# EAGLE design tinyclock (EAGLE 8.3.2)
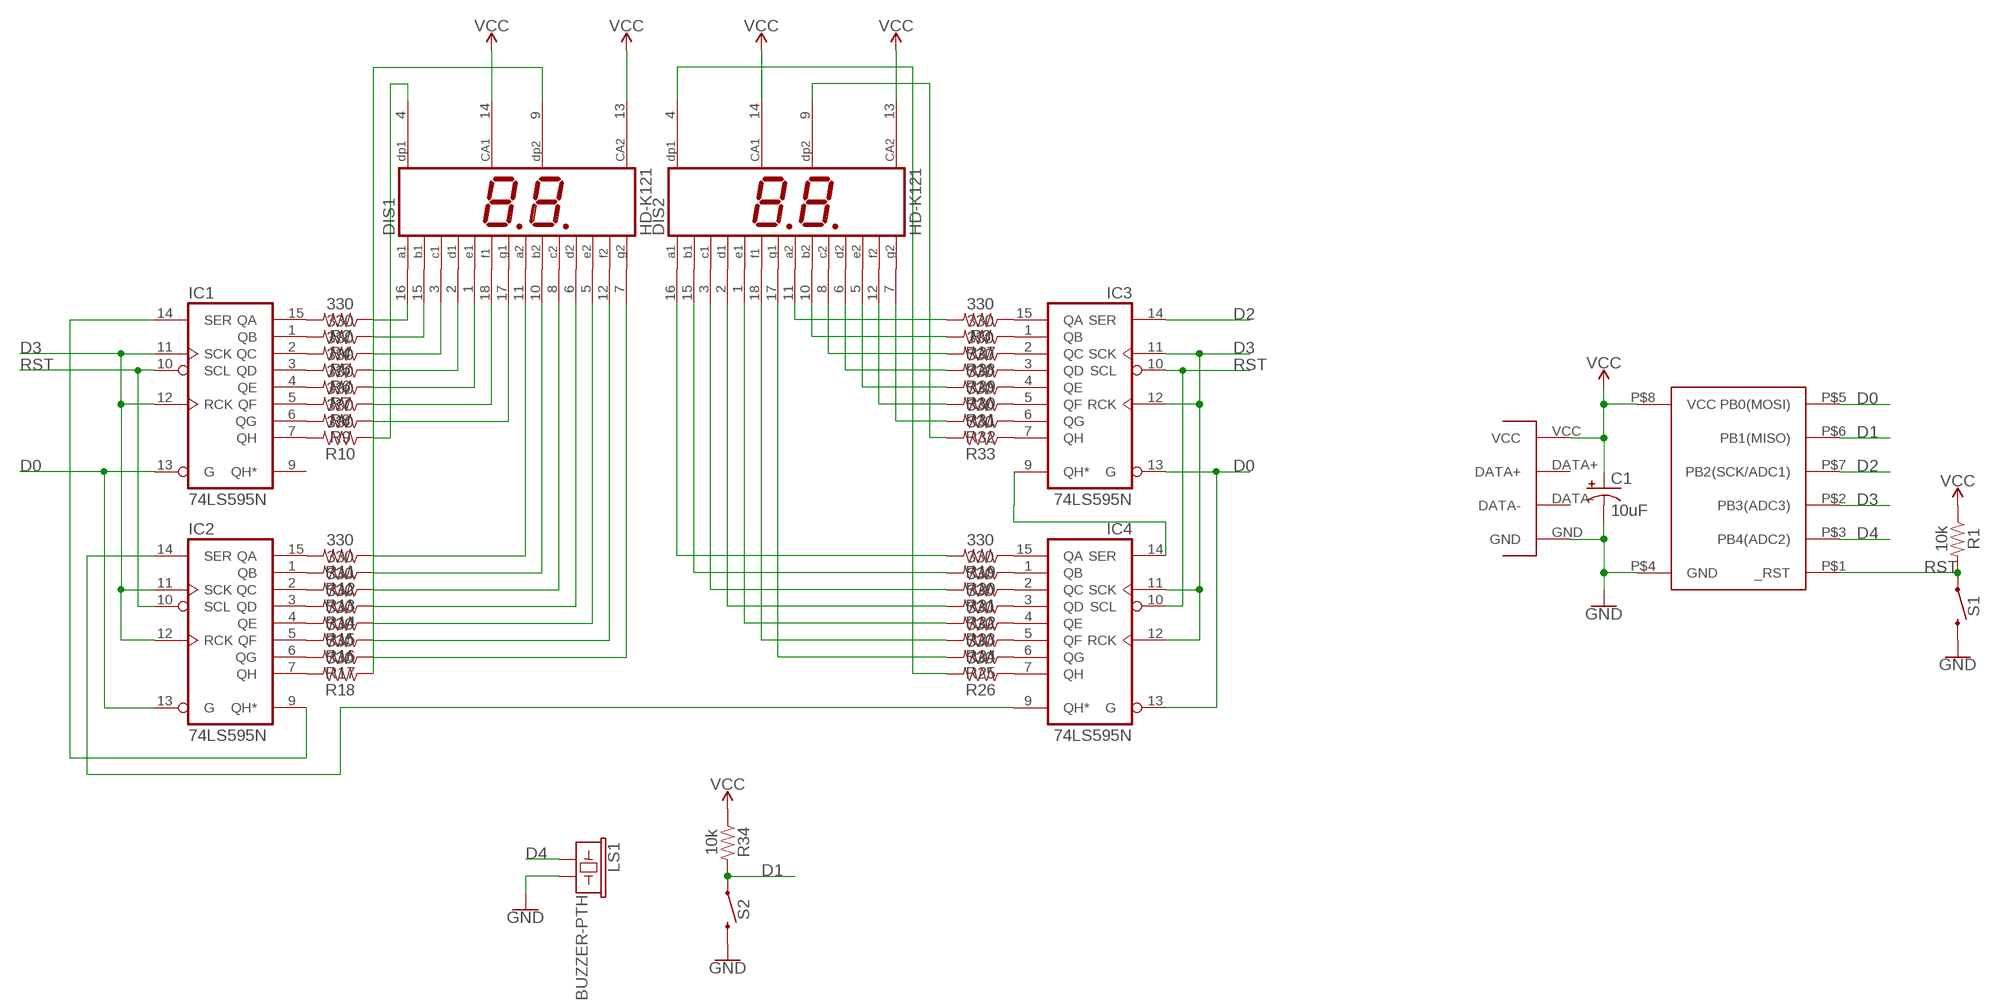
[diagram p0: schematic, sheet 1]

## Parts
C1  10uF  1000UF-RADIAL-5MM-25V-20%  [CPOL-RADIAL-5MM-10MM]
DIS1  HD-K121  [HDSP-R]
DIS2  HD-K121  [HDSP-R]
IC1  74LS595N  [DIL16]
IC2  74LS595N  [DIL16]
IC3  74LS595N  [DIL16]
IC4  74LS595N  [DIL16]
LS1  BUZZER-PTH  [BUZZER-12MM]
R1  10k  1KOHM-VERT-1/4W-5%  [AXIAL-0.1]
R2  330  1KOHM-VERT-1/4W-5%  [AXIAL-0.1]
R3  330  1KOHM-VERT-1/4W-5%  [AXIAL-0.1]
R4  330  1KOHM-VERT-1/4W-5%  [AXIAL-0.1]
R5  330  1KOHM-VERT-1/4W-5%  [AXIAL-0.1]
R6  330  1KOHM-VERT-1/4W-5%  [AXIAL-0.1]
R7  330  1KOHM-VERT-1/4W-5%  [AXIAL-0.1]
R8  330  1KOHM-VERT-1/4W-5%  [AXIAL-0.1]
R9  330  1KOHM-VERT-1/4W-5%  [AXIAL-0.1]
R10  330  1KOHM-VERT-1/4W-5%  [AXIAL-0.1]
R11  330  1KOHM-VERT-1/4W-5%  [AXIAL-0.1]
R12  330  1KOHM-VERT-1/4W-5%  [AXIAL-0.1]
R13  330  1KOHM-VERT-1/4W-5%  [AXIAL-0.1]
R14  330  1KOHM-VERT-1/4W-5%  [AXIAL-0.1]
R15  330  1KOHM-VERT-1/4W-5%  [AXIAL-0.1]
R16  330  1KOHM-VERT-1/4W-5%  [AXIAL-0.1]
R17  330  1KOHM-VERT-1/4W-5%  [AXIAL-0.1]
R18  330  1KOHM-VERT-1/4W-5%  [AXIAL-0.1]
R19  330  1KOHM-VERT-1/4W-5%  [AXIAL-0.1]
R20  330  1KOHM-VERT-1/4W-5%  [AXIAL-0.1]
R21  330  1KOHM-VERT-1/4W-5%  [AXIAL-0.1]
R22  330  1KOHM-VERT-1/4W-5%  [AXIAL-0.1]
R23  330  1KOHM-VERT-1/4W-5%  [AXIAL-0.1]
R24  330  1KOHM-VERT-1/4W-5%  [AXIAL-0.1]
R25  330  1KOHM-VERT-1/4W-5%  [AXIAL-0.1]
R26  330  1KOHM-VERT-1/4W-5%  [AXIAL-0.1]
R27  330  1KOHM-VERT-1/4W-5%  [AXIAL-0.1]
R28  330  1KOHM-VERT-1/4W-5%  [AXIAL-0.1]
R29  330  1KOHM-VERT-1/4W-5%  [AXIAL-0.1]
R30  330  1KOHM-VERT-1/4W-5%  [AXIAL-0.1]
R31  330  1KOHM-VERT-1/4W-5%  [AXIAL-0.1]
R32  330  1KOHM-VERT-1/4W-5%  [AXIAL-0.1]
R33  330  1KOHM-VERT-1/4W-5%  [AXIAL-0.1]
R34  10k  1KOHM-VERT-1/4W-5%  [AXIAL-0.1]
S1  MOMENTARY-SWITCH-SPST-PTH-6.0MM  [TACTILE_SWITCH_PTH_6.0MM]
S2  MOMENTARY-SWITCH-SPST-PTH-6.0MM  [TACTILE_SWITCH_PTH_6.0MM]
U$1  ATTINY85-DIP8  [DIP8]
U$2  USBPCB  [USBPCB]

## Nets
D0: IC1.13(G) IC2.13(G) IC3.13(G) IC4.13(G) U$1.P$5(PB0(MOSI))
D1: R34.P$2 S2.1 U$1.P$6(PB1(MISO))
D2: IC3.14(SER) U$1.P$7(PB2(SCK/ADC1))
D3: IC1.11(SCK) IC1.12(RCK) IC2.11(SCK) IC2.12(RCK) IC3.11(SCK) IC3.12(RCK) IC4.11(SCK) IC4.12(RCK) U$1.P$2(PB3(ADC3))
D4: LS1.+ U$1.P$3(PB4(ADC2))
GND: C1.- LS1.- S1.3 S2.3 U$1.P$4(GND) U$2.GND
N$1: IC1.15(QA) R2.P$2
N$2: IC2.14(SER) IC4.9(QH*)
N$3: DIS1.16(A1) R2.P$1
N$4: IC1.1(QB) R4.P$2
N$5: IC1.2(QC) R5.P$2
N$6: IC1.3(QD) R6.P$2
N$7: IC1.4(QE) R7.P$2
N$8: IC1.5(QF) R8.P$2
N$9: IC1.6(QG) R9.P$2
N$10: IC1.7(QH) R10.P$2
N$11: DIS1.15(B1) R4.P$1
N$12: DIS1.3(C1) R5.P$1
N$13: DIS1.2(D1) R6.P$1
N$14: DIS1.1(E1) R7.P$1
N$15: DIS1.18(F1) R8.P$1
N$16: DIS1.17(G1) R9.P$1
N$17: IC2.15(QA) R11.P$2
N$18: IC2.1(QB) R12.P$2
N$19: IC2.2(QC) R13.P$2
N$20: IC2.3(QD) R14.P$2
N$21: IC2.4(QE) R15.P$2
N$22: IC2.5(QF) R16.P$2
N$23: IC2.6(QG) R17.P$2
N$24: IC2.7(QH) R18.P$2
N$25: IC3.15(QA) R3.P$1
N$26: IC3.1(QB) R27.P$1
N$27: IC3.2(QC) R28.P$1
N$28: IC3.3(QD) R29.P$1
N$29: IC3.4(QE) R30.P$1
N$30: IC3.5(QF) R31.P$1
N$31: IC3.6(QG) R32.P$1
N$32: IC3.7(QH) R33.P$1
N$33: IC4.15(QA) R19.P$1
N$34: IC4.1(QB) R20.P$1
N$35: IC4.2(QC) R21.P$1
N$36: IC4.3(QD) R22.P$1
N$37: IC4.4(QE) R23.P$1
N$38: IC4.5(QF) R24.P$1
N$39: IC4.6(QG) R25.P$1
N$40: IC4.7(QH) R26.P$1
N$41: DIS1.4(DP1) R10.P$1
N$42: DIS1.11(A2) R11.P$1
N$43: DIS1.10(B2) R12.P$1
N$44: DIS1.8(C2) R13.P$1
N$45: DIS1.6(D2) R14.P$1
N$46: DIS1.5(E2) R15.P$1
N$47: DIS1.12(F2) R16.P$1
N$48: DIS1.7(G2) R17.P$1
N$49: DIS1.9(DP2) R18.P$1
N$50: DIS2.11(A2) R3.P$2
N$51: DIS2.10(B2) R27.P$2
N$52: DIS2.8(C2) R28.P$2
N$53: DIS2.6(D2) R29.P$2
N$54: DIS2.5(E2) R30.P$2
N$55: DIS2.12(F2) R31.P$2
N$56: DIS2.7(G2) R32.P$2
N$57: DIS2.9(DP2) R33.P$2
N$58: DIS2.16(A1) R19.P$2
N$59: DIS2.15(B1) R20.P$2
N$60: DIS2.3(C1) R21.P$2
N$61: DIS2.2(D1) R22.P$2
N$62: DIS2.1(E1) R23.P$2
N$63: DIS2.18(F1) R24.P$2
N$64: DIS2.17(G1) R25.P$2
N$65: DIS2.4(DP1) R26.P$2
N$66: IC3.9(QH*) IC4.14(SER)
N$70: IC1.14(SER) IC2.9(QH*)
RST: IC1.10(SCL) IC2.10(SCL) IC3.10(SCL) IC4.10(SCL) R1.P$2 S1.1 U$1.P$1(_RST)
VCC: C1.+ DIS1.13(CA2) DIS1.14(CA1) DIS2.13(CA2) DIS2.14(CA1) R1.P$1 R34.P$1 U$1.P$8(VCC) U$2.VCC
Unconnected: IC1.9(QH*) U$2.DATA+ U$2.DATA-

## Power pins joined to a net without a drawn wire
GND: IC1.8(GND) IC2.8(GND) IC3.8(GND) IC4.8(GND)
VCC: IC1.16(VCC) IC2.16(VCC) IC3.16(VCC) IC4.16(VCC)

## Library data of the parts
C1 = SparkFun-Capacitors:1000UF: 1,000µF/1mF ceramic capacitors A capacitor is a passive two-terminal electrical component used to store electrical energy temporarily in an electric field. CAP-08070; PROD_ID: CAP-09538; VALUE: 1mF
DIS1 DIS2 = display-hp:HD-K121: LED DISPLAY 2 x 1 character 7 segment, decimal points right; OC_FARNELL: unknown; OC_NEWARK: unknown
IC1-IC4 = 74xx-us:74*595: 8-bit SHIFT REGISTER, output latch
LS1 = SparkFun-Electromechanical:BUZZER: Buzzer Small round buzzers that operate around the audible 2kHz range. You can use these as speakers to create simple music or user interfaces. Variant Overview: PTH - Mini Speaker - PC Mount 12mm 2.048kHz <https://www.sparkfun.com/products/7950> PTH_KIT - Mini Speaker - PC Mount 12mm 2.048kHz <https://www.sparkfun.com/products/7950> KIT simplifies soldering by adding stop mask to one side of the pads. PTH_NO_SILK - Mini Speaker - PC Mount 12mm 2.048kHz <https://www.sparkfun.com/products/7950> No silkscreen indicator of buzzer outline. PTH_KIT_NO_SILK - Mini Speaker - PC Mount 12mm 2.048kHz <https://www.sparkfun.com/products/7950> KIT package w/o silkscreen SMD - Buzzer Audio Magnetic (CCV-084B16) SMD buzzer used on, e.g. the LilyPad Buzzer <https://www.sparkfun.com/products/8463> and RFID USB Reader <https://www.sparkfun.com/products/9963>. SMD_KIT - Buzzer Audio Magnetic (CCV-084B16) SMD Buzzer with elongated pins to make soldering easier. Used on the SparkFun Simon Says - Surface Mount Soldering Kit <https://www.sparkfun.com/products/10935>.; PROD_ID: COMP-08253; SF_SKU: COM-07950
R1-R34 = SparkFun-Resistors:1KOHM: 1kΩ resistor A resistor is a passive two-terminal electrical component that implements electrical resistance as a circuit element. Resistors act to reduce current flow, and, at the same time, act to lower voltage levels within circuits. - Wikipedia; PROD_ID: RES-08380; VALUE: 1k
S1 S2 = SparkFun-Switches:MOMENTARY-SWITCH-SPST: Momentary Switch (Pushbutton) - SPST Normally-open (NO) SPST momentary switches (buttons, pushbuttons). Variants PTH-12MM - 12mm square, through-hole Momentary Pushbutton Switch - 12mm Square <https://www.sparkfun.com/products/9190> (COM-09190) PTH-6.0MM, PTH-6.0MM-KIT - 6.0mm square, through-hole Mini Pushbutton Switch <https://www.sparkfun.com/products/97> (COM-00097) KIT package intended for soldering kit's - only one side of pads' copper is exposed. PTH-RIGHT-ANGLE-KIT - Right-angle, through-hole Right Angle Tactile Button <https://www.sparkfun.com/products/10791> - Used on SparkFun BigTime Watch Kit <https://www.sparkfun.com/products/11734> SMD-12MM - 12mm square, surface-mount Tactile Button - SMD (12mm) <https://www.sparkfun.com/products/12993> (COM-12993) Used on SparkFun PicoBoard <https://www.sparkfun.com/products/11888> SMD-4.5MM - 4.5mm Square Trackball Switch Used on SparkFun Blackberry Trackballer Breakout <https://www.sparkfun.com/products/13169> SMD-4.6MMX2.8MM - 4.60mm x 2.80mm, surface mount Used on SparkFun SAMD21 Mini Breakout <https://www.sparkfun.com/products/13664> SMD-5.2MM, SMD-5.2-REDUNDANT - 5.2mm square, surface-mount Mini Pushbutton Switch - SMD <https://www.sparkfun.com/products/8720> (COM-08720) Used on Arduino Pro Mini <https://www.sparkfun.com/products/11114> REDUNDANT package connects both switch circuits together SMD-6.0X3.5MM - 6.0 x 3.5mm, surface mount Momentary Reset Switch SMD <https://www.sparkfun.com/products/8229> (COM-08229) SMD-6.2MM-TALL - 6.2mm square, surface mount Tactile Button - SMD (6mm) <https://www.sparkfun.com/products/12992> Used on SparkFun Digital Sandbox <https://www.sparkfun.com/products/12651> SMD-RIGHT-ANGLE - Right-angle, surface mount Used on SparkFun Block for Intel® Edison - Arduino <https://www.sparkfun.com/products/13036>; PROD_ID: SWCH-08441; SF_SKU: COM-00097
U$1 = dip8pkg:ATTINY85-DIP8
U$2 = usbpcb:USBPCB

## Board
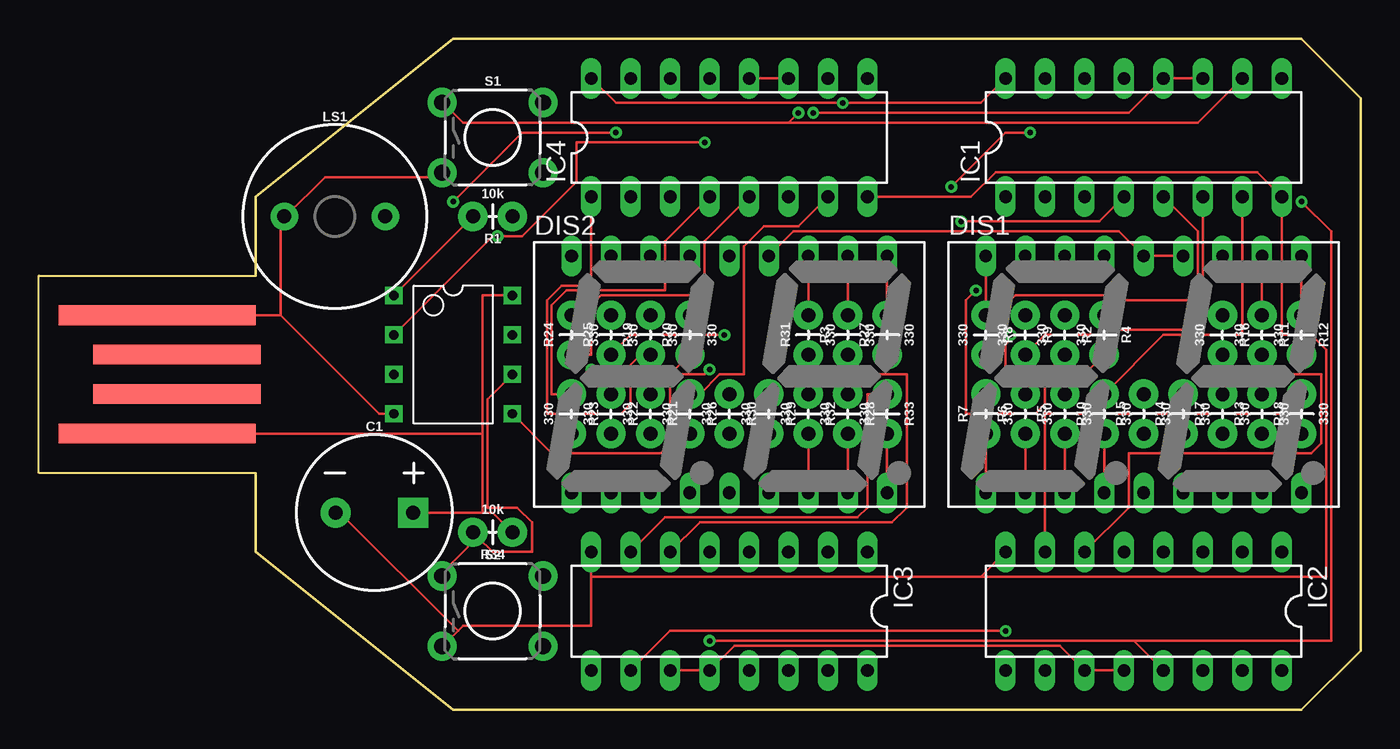
[diagram p1: board, top side]
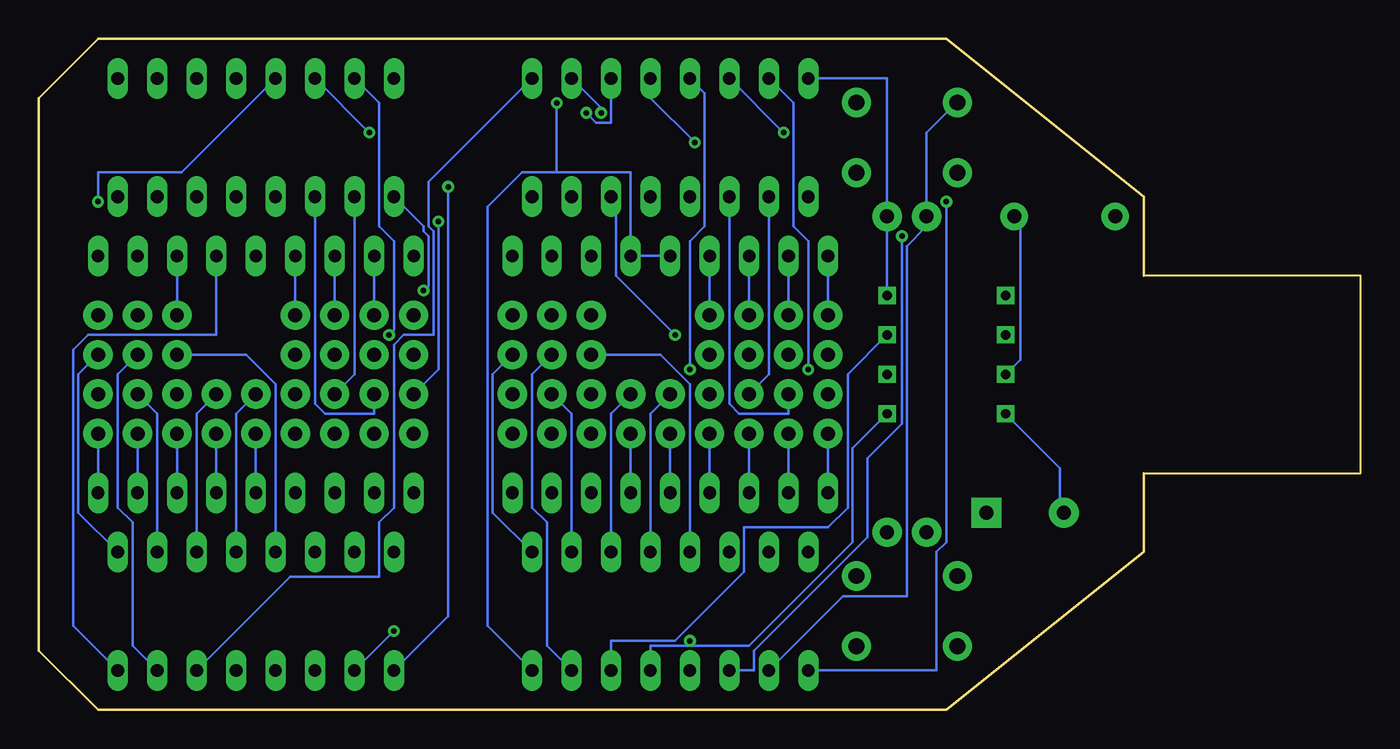
[diagram p2: board, bottom side, seen from below]

Size 85.09 x 43.18 mm. Coordinates in mm from the lower left corner, seen from the top.
Outline: 13.97,27.94 13.97,33.02 26.67,43.18 81.28,43.18 85.09,39.37 85.09,3.81 81.28,0 26.67,0 13.97,10.16 13.97,15.24
Copper layers (1*16): Top 0.035mm / dielectric 1.5mm / Bottom 0.035mm
Design rules "default": minimum track width 6mil, minimum drill 0.35mm, track to track 6mil, track to pad 6mil, pad to pad 6mil, via to via 6mil, smd to smd 6mil, copper to edge 40mil, drill to drill 6mil, minimum pad ring 10mil, minimum via ring 8mil, stop-mask expansion 4mil, vias tented up to drill 0mil, thermal gap 10mil

### Footprints (pad centres in the part's own frame; a part is rotated, then mirrored left to right if it is on the bottom)
CPOL-RADIAL-5MM-10MM = drill 0.9 pad 1.93 square: + 2.5,0 | drill 0.9 pad 1.93: - -2.5,0
HDSP-R = drill 0.813 long: 1 -10.16,-7.62; 2 -7.62,-7.62; 3 -5.08,-7.62; 4 -2.54,-7.62; 5 0,-7.62; 6 2.54,-7.62; 7 5.08,-7.62; 8 7.62,-7.62; 9 10.16,-7.62; 10 10.16,7.62; 11 7.62,7.62; 12 5.08,7.62; 13 2.54,7.62; 14 0,7.62; 15 -2.54,7.62; 16 -5.08,7.62; 17 -7.62,7.62; 18 -10.16,7.62
DIL16 = drill 0.813 long: 1 -8.89,-3.81; 2 -6.35,-3.81; 3 -3.81,-3.81; 4 -1.27,-3.81; 5 1.27,-3.81; 6 3.81,-3.81; 7 6.35,-3.81; 8 8.89,-3.81; 9 8.89,3.81; 10 6.35,3.81; 11 3.81,3.81; 12 1.27,3.81; 13 -1.27,3.81; 14 -3.81,3.81; 15 -6.35,3.81; 16 -8.89,3.81
BUZZER-12MM = drill 0.9 pad 1.778: + 3.25,0; - -3.25,0
AXIAL-0.1 = drill 0.9 pad 1.88: P$1 -1.27,0; P$2 1.27,0
TACTILE_SWITCH_PTH_6.0MM = drill 1.016 pad 1.88: 1 -3.251,2.261; 2 3.251,2.261; 3 -3.251,-2.261; 4 3.251,-2.261
DIP8 = drill 0.6 square: P$1 -3.81,3.81; P$2 -3.81,1.27; P$3 -3.81,-1.27; P$4 -3.81,-3.81; P$5 3.81,-3.81; P$6 3.81,-1.27; P$7 3.81,1.27; P$8 3.81,3.81
USBPCB = smd 1.27 x 10.795: DATA+ 1.27,2.54; DATA- -1.27,2.54 | smd 1.27 x 12.7: GND 3.81,3.81; VCC -3.81,3.81

### Placement (x,y rotation side)
C1  21.59,12.7 0 top
DIS1  71.12,21.59 0 top
DIS2  44.45,21.59 0 top
IC1  71.12,36.83 0 top
IC2  71.12,6.35 180 top
IC3  44.45,6.35 180 top
IC4  44.45,36.83 0 top
LS1  19.05,31.75 0 top
R1  29.21,31.75 180 top
R2  66.04,24.13 270 top
R3  52.07,24.13 90 top
R4  68.58,24.13 270 top
R5  66.04,19.05 90 top
R6  63.5,19.05 90 top
R7  60.96,19.05 90 top
R8  60.96,24.13 270 top
R9  63.5,24.13 270 top
R10  68.58,19.05 90 top
R11  78.74,24.13 270 top
R12  81.28,24.13 270 top
R13  78.74,19.05 90 top
R14  73.66,19.05 90 top
R15  71.12,19.05 90 top
R16  76.2,24.13 270 top
R17  76.2,19.05 90 top
R18  81.28,19.05 90 top
R19  39.37,24.13 90 top
R20  41.91,24.13 90 top
R21  39.37,19.05 270 top
R22  36.83,19.05 270 top
R23  34.29,19.05 270 top
R24  34.29,24.13 90 top
R25  36.83,24.13 90 top
R26  41.91,19.05 270 top
R27  54.61,24.13 90 top
R28  52.07,19.05 270 top
R29  46.99,19.05 270 top
R30  44.45,19.05 270 top
R31  49.53,24.13 90 top
R32  49.53,19.05 270 top
R33  54.61,19.05 270 top
R34  29.21,11.43 180 top
S1  29.21,36.83 0 top
S2  29.21,6.35 0 top
U$1  26.67,22.86 0 top
U$2  11.43,21.59 90 top

### Tracks (layer width: path | path; a pad name or v marks a point on that pad's centre or on a via)
D0  (via drill 0.35)
  Top 0.152: 70.48,4.45 IC2.13 | v43.18,4.45 70.48,4.45 | v43.18,21.91 42.86,21.59 41.28,21.59 40.64,20.95 40.64,16.83 40.32,16.83 40.01,16.51 33.02,16.51 U$1.P$5 | v81.28,32.7 83.19,30.8 83.19,4.45 70.48,4.45
  Bottom 0.152: U$1.P$5 32.7,16.83 32.7,10.79 39.37,4.13 43.18,4.13 | 43.18,4.13 45.72,4.13 IC3.13 | 43.18,4.13 v43.18,4.45 | IC4.13 42.23,39.69 42.23,31.11 43.18,30.16 v43.18,21.91 | IC1.13 75.88,34.61 81.28,34.61 v81.28,32.7
D1
  Top 0.152: U$1.P$6 28.89,20 28.89,13.02 30.8,13.02 31.75,12.06 31.75,10.16 29.21,10.16 28.26,11.11 | 28.26,11.11 26.04,8.89 S2.1 | 28.26,11.11 R34.P$2
D2
  Bottom 0.152: U$1.P$7 33.02,21.59 33.02,13.02 34.29,11.75 39.69,11.75 39.69,8.89 44.13,4.45 48.26,4.45 IC3.14
D3  (via drill 0.35)
  Top 0.152: IC3.11 IC3.12 44.77,4.13 65.72,4.13 IC2.11 IC2.12 | IC1.11 IC1.12 70.17,38.42 v49.85,38.42 | U$1.P$2 29.21,30.48 v29.53,30.48 31.12,30.48 34.61,33.97 34.61,36.51 v42.86,36.51 | IC4.12 IC4.11
  Bottom 0.152: v42.86,36.51 45.72,39.37 IC4.12 | v49.85,38.42 49.21,37.78 48.26,37.78 IC4.11 | IC3.11 39.05,2.54 39.05,3.81 31.75,11.11 31.75,16.19 29.53,18.41 v29.53,30.48
D4
  Bottom 0.152: U$1.P$3 21.91,22.54 21.91,31.43 22.23,31.75 LS1.+
GND
  Top 0.152: S1.3 25.72,34.29 18.41,34.29 15.88,31.75 LS1.- 15.56,31.75 15.56,25.4 | U$2.GND 15.56,25.4 | IC4.8 60.01,33.02 61.59,34.61 78.42,34.61 IC1.8 80.01,24.13 81.91,24.13 82.87,23.18 82.87,8.57 60.64,8.57 | 35.56,8.57 35.56,5.4 27.31,5.4 26.99,5.08 | 35.56,8.57 IC3.8 | 26.99,5.08 26.04,4.13 S2.3 | 60.64,8.57 IC2.8 | 35.56,8.57 60.64,8.57 | 26.99,5.08 19.37,12.7 C1.- | 15.56,25.4 21.91,19.05 U$1.P$4
  Bottom 0.152: U$1.P$4 19.37,15.56 19.37,12.7 C1.-
N$1  (via drill 0.35)
  Top 0.152: v62.55,24.13 62.55,23.81 62.23,23.5 62.23,21.59 64.77,21.59 R2.P$2
  Bottom 0.152: IC1.15 63.18,39.05 63.18,31.11 62.23,30.16 62.23,24.45 v62.55,24.13
N$2
  Bottom 0.152: IC2.14 68.9,8.57 63.18,8.57 63.18,12.06 62.23,13.02 62.23,23.5 61.59,24.13 59.69,24.13 59.69,30.8 60.01,31.11 60.01,33.97 IC4.9
N$3
  Bottom 0.152: R2.P$1 DIS1.16
N$4  (via drill 0.35)
  Top 0.152: v60.33,26.99 59.69,26.35 59.69,19.05 64.14,19.05 64.77,19.68 64.77,21.27 65.09,21.27 65.41,21.59 67.31,21.59 R4.P$2
  Bottom 0.152: IC1.1 60.33,31.11 60.33,30.8 60.01,30.48 60.01,27.3 v60.33,26.99
N$5
  Bottom 0.152: IC1.2 64.77,21.59 R5.P$2
N$6
  Bottom 0.152: IC1.3 67.31,19.68 66.68,19.05 63.5,19.05 R6.P$2
N$7  (via drill 0.35)
  Top 0.152: IC1.4 68.26,31.43 v59.37,31.43
  Bottom 0.152: v59.37,31.43 59.37,21.91 R7.P$2
N$8
  Top 0.152: IC1.5 74.61,30.8 74.61,26.35 69.53,26.35 69.22,26.67 62.87,26.67 62.23,26.04 62.23,24.77 60.96,23.5 R8.P$2
N$9
  Top 0.152: IC1.6 74.93,24.45 69.53,24.45 69.22,24.13 64.77,24.13 R9.P$2
N$10
  Top 0.152: IC1.7 77.47,24.13 72.39,24.13 R10.P$2
N$11
  Bottom 0.152: R4.P$1 DIS1.15
N$12
  Top 0.152: R5.P$1 DIS1.3
N$13
  Top 0.152: R6.P$1 DIS1.2
N$14
  Top 0.152: R7.P$1 DIS1.1
N$15
  Top 0.152: R8.P$1 DIS1.18
N$16
  Bottom 0.152: R9.P$1 DIS1.17
N$17
  Bottom 0.152: IC2.15 79.06,4.13 79.06,12.06 80.01,13.02 80.01,21.59 R11.P$2
N$18
  Bottom 0.152: IC2.1 82.55,12.7 82.55,21.59 R12.P$2
N$19
  Bottom 0.152: IC2.2 77.47,19.05 R13.P$2
N$20
  Bottom 0.152: IC2.3 74.93,19.05 R14.P$2
N$21
  Bottom 0.152: IC2.4 72.39,19.05 R15.P$2
N$22
  Bottom 0.152: IC2.5 69.85,20.95 71.75,22.86 R16.P$2
N$23
  Top 0.152: IC2.6 70.17,13.02 70.17,16.51 81.91,16.51 82.55,17.14 82.55,21.59 77.47,21.59 R17.P$2
N$24
  Top 0.152: IC2.7 64.77,19.05 80.01,19.05 R18.P$2
N$25
  Bottom 0.152: IC3.15 52.39,4.13 52.39,12.06 53.34,13.02 53.34,21.59 R3.P$1
N$26
  Bottom 0.152: IC3.1 55.88,12.7 55.88,21.59 R27.P$1
N$27
  Bottom 0.152: IC3.2 50.8,19.05 R28.P$1
N$28
  Bottom 0.152: IC3.3 48.26,19.05 R29.P$1
N$29
  Bottom 0.152: IC3.4 45.72,19.05 R30.P$1
N$30
  Bottom 0.152: IC3.5 43.18,20.95 45.09,22.86 R31.P$1
N$31
  Top 0.152: IC3.6 42.55,12.06 54.93,12.06 55.88,13.02 55.88,21.59 50.8,21.59 R32.P$1
N$32
  Top 0.152: IC3.7 40.32,12.38 52.7,12.38 53.34,13.02 53.34,20.32 R33.P$1
N$33  (via drill 0.35)
  Top 0.152: v35.56,21.91 35.88,21.59 37.47,21.59 38.73,22.86 R19.P$1
  Bottom 0.152: IC4.15 36.51,39.05 36.51,31.11 35.56,30.16 v35.56,21.91
N$34
  Top 0.152: IC4.1 35.56,27.3 33.66,27.3 32.7,26.35 32.7,19.05 37.47,19.05 38.1,19.68 38.1,21.59 40.64,21.59 R20.P$1
N$35
  Bottom 0.152: IC4.2 38.1,21.59 R21.P$1
N$36
  Bottom 0.152: IC4.3 40.64,19.68 40.01,19.05 36.83,19.05 R22.P$1
N$37
  Top 0.152: IC4.4 40.32,30.16 40.32,26.99 33.97,26.99 33.02,26.04 33.02,20.32 R23.P$1
N$38
  Top 0.152: IC4.5 42.86,30.16 42.86,26.67 36.2,26.67 35.56,26.04 35.56,22.86 R24.P$1
N$39  (via drill 0.35)
  Top 0.152: v44.13,24.13 38.1,24.13 R25.P$1
  Bottom 0.152: IC4.6 47.94,32.7 47.94,27.94 v44.13,24.13
N$40
  Top 0.152: IC4.7 48.9,31.11 46.67,31.11 45.4,29.84 45.4,21.59 43.81,21.59 42.55,20.32 R26.P$1
N$41
  Top 0.152: R10.P$1 DIS1.4
N$42
  Top 0.152: R11.P$1 DIS1.11
N$43
  Top 0.152: R12.P$1 DIS1.10
N$44
  Bottom 0.152: R13.P$1 DIS1.8
N$45
  Bottom 0.152: R14.P$1 DIS1.6
N$46
  Bottom 0.152: R15.P$1 DIS1.5
N$47
  Bottom 0.152: R16.P$1 DIS1.12
N$48
  Bottom 0.152: R17.P$1 DIS1.7
N$49
  Bottom 0.152: R18.P$1 DIS1.9
N$50
  Top 0.152: R3.P$2 DIS2.11
N$51
  Top 0.152: R27.P$2 DIS2.10
N$52
  Top 0.152: R28.P$2 DIS2.8
N$53
  Bottom 0.152: R29.P$2 DIS2.6
N$54
  Bottom 0.152: R30.P$2 DIS2.5
N$55
  Top 0.152: R31.P$2 DIS2.12
N$56
  Top 0.152: R32.P$2 DIS2.7
N$57
  Top 0.152: R33.P$2 DIS2.9
N$58
  Bottom 0.152: R19.P$2 DIS2.16
N$59
  Bottom 0.152: R20.P$2 DIS2.15
N$60
  Bottom 0.152: R21.P$2 DIS2.3
N$61
  Bottom 0.152: R22.P$2 DIS2.2
N$62
  Bottom 0.152: R23.P$2 DIS2.1
N$63
  Bottom 0.152: R24.P$2 DIS2.18
N$64
  Bottom 0.152: R25.P$2 DIS2.17
N$65
  Bottom 0.152: R26.P$2 DIS2.4
N$66  (via drill 0.35)
  Top 0.152: v26.67,32.7 31.12,37.15 v37.15,37.15
  Bottom 0.152: IC3.9 27.31,2.54 27.31,10.16 26.67,10.79 v26.67,32.7 | IC4.14 v37.15,37.15
N$70  (via drill 0.35)
  Top 0.152: v58.74,33.66 62.23,37.15 v63.82,37.15
  Bottom 0.152: IC2.9 58.74,6.03 v58.74,33.66 | IC1.14 v63.82,37.15
RST  (via drill 0.35)
  Top 0.152: 48.26,37.78 v48.9,38.42 | 48.26,37.78 27.31,37.78 26.04,39.05 S1.1 | IC1.10 74.61,37.78 48.26,37.78 | R1.P$2 U$1.P$1 | v62.23,5.08 40.64,5.08 IC3.10
  Bottom 0.152: IC4.10 48.9,38.73 v48.9,38.42 | IC3.10 33.34,7.3 29.21,7.3 29.21,29.84 27.94,31.11 R1.P$2 27.94,37.15 26.04,39.05 S1.1 | v62.23,5.08 IC2.10
VCC  (via drill 0.35)
  Top 0.152: DIS1.13 DIS1.14 69.53,30.8 48.58,30.8 DIS2.13 | R34.P$1 29.21,12.7 28.58,12.7 | C1.+ 28.58,12.7 | IC1.16 60.64,39.05 v51.75,39.05 37.15,39.05 IC4.16 | 28.58,17.78 28.58,26.67 U$1.P$8 | 28.58,17.78 28.58,12.7 | 28.58,17.78 U$2.VCC
  Bottom 0.152: IC2.16 82.87,5.4 82.87,23.18 81.91,24.13 73.66,24.13 DIS1.13 | DIS2.14 DIS2.13 46.99,34.61 51.75,34.61 | IC3.16 56.2,5.4 56.2,32.38 53.98,34.61 51.75,34.61 | U$1.P$8 R1.P$1 30.48,40.64 IC4.16 | v51.75,39.05 51.75,34.61